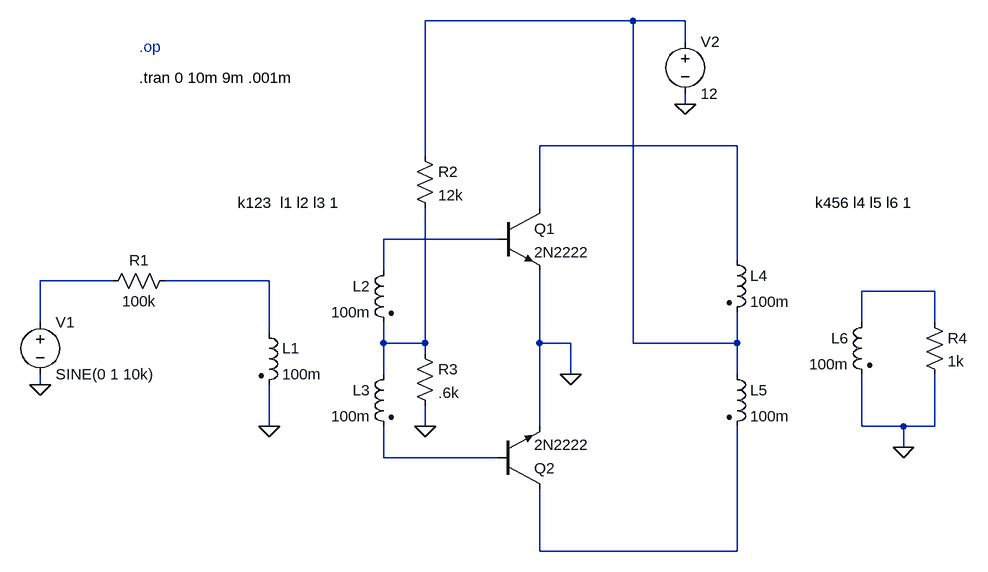
[diagram p0: schematic pushpull.asc]
pushpull.asc, the LTspice schematic file:
Version 4
SHEET 1 2424 680
WIRE 1904 -512 1584 -512
WIRE 1984 -512 1904 -512
WIRE 1984 -480 1984 -512
WIRE 1984 -384 1984 -400
WIRE 2064 -320 1760 -320
WIRE 1584 -304 1584 -512
WIRE 1760 -224 1760 -320
WIRE 1696 -176 1520 -176
WIRE 2064 -144 2064 -320
WIRE 1520 -128 1520 -176
WIRE 1104 -112 992 -112
WIRE 1344 -112 1184 -112
WIRE 2368 -96 2256 -96
WIRE 992 -48 992 -112
WIRE 2256 -48 2256 -96
WIRE 2368 -48 2368 -96
WIRE 1344 -32 1344 -112
WIRE 1520 -16 1520 -48
WIRE 1584 -16 1584 -224
WIRE 1584 -16 1520 -16
WIRE 1760 -16 1760 -128
WIRE 1808 -16 1760 -16
WIRE 1904 -16 1904 -512
WIRE 2064 -16 2064 -64
WIRE 2064 -16 1904 -16
WIRE 1584 0 1584 -16
WIRE 1520 32 1520 -16
WIRE 1808 32 1808 -16
WIRE 2064 32 2064 -16
WIRE 992 48 992 32
WIRE 1344 112 1344 48
WIRE 1584 112 1584 80
WIRE 1760 112 1760 -16
WIRE 2256 112 2256 32
WIRE 2320 112 2256 112
WIRE 2368 112 2368 32
WIRE 2368 112 2320 112
WIRE 2320 144 2320 112
WIRE 1520 160 1520 112
WIRE 1696 160 1520 160
WIRE 1760 304 1760 208
WIRE 2064 304 2064 112
WIRE 2064 304 1760 304
FLAG 1808 32 0
FLAG 2320 144 0
FLAG 1584 112 0
FLAG 1984 -384 0
FLAG 1344 112 0
FLAG 992 48 0
DATAFLAG 1584 -16 ""
SYMBOL npn 1696 -224 R0
SYMATTR InstName Q1
SYMATTR Value 2N2222
SYMBOL npn 1696 208 M180
SYMATTR InstName Q2
SYMATTR Value 2N2222
SYMBOL ind2 2048 16 R0
SYMATTR InstName L5
SYMATTR Value 100m
SYMATTR Type ind
SYMBOL ind2 2048 -160 R0
SYMATTR InstName L4
SYMATTR Value 100m
SYMATTR Type ind
SYMBOL ind2 2272 -64 M0
SYMATTR InstName L6
SYMATTR Value 100m
SYMATTR Type ind
SYMBOL res 2352 -64 R0
SYMATTR InstName R4
SYMATTR Value 1k
SYMBOL ind2 1536 -144 M0
SYMATTR InstName L2
SYMATTR Value 100m
SYMATTR Type ind
SYMBOL ind2 1536 16 M0
SYMATTR InstName L3
SYMATTR Value 100m
SYMATTR Type ind
SYMBOL res 1568 -16 R0
SYMATTR InstName R3
SYMATTR Value .6k
SYMBOL res 1568 -320 R0
SYMATTR InstName R2
SYMATTR Value 12k
SYMBOL voltage 1984 -496 R0
WINDOW 123 0 0 Left 0
WINDOW 39 0 0 Left 0
SYMATTR InstName V2
SYMATTR Value 12
SYMBOL ind2 1328 -48 R0
SYMATTR InstName L1
SYMATTR Value 100m
SYMATTR Type ind
SYMBOL res 1200 -128 R90
WINDOW 0 0 56 VBottom 2
WINDOW 3 32 56 VTop 2
SYMATTR InstName R1
SYMATTR Value 100k
SYMBOL voltage 992 -64 R0
WINDOW 123 0 0 Left 0
WINDOW 39 0 0 Left 0
SYMATTR InstName V1
SYMATTR Value SINE(0 1 10k)
TEXT 1144 -472 Left 2 ;.op
TEXT 1144 -424 Left 2 !.tran 0 10m 9m .001m
TEXT 2184 -232 Left 2 !k456 l4 l5 l6 1
TEXT 1296 -232 Left 2 !k123  l1 l2 l3 1

The netlist it stands for:
* pushpull.asc
Q1 N002 N003 0 0 2N2222
Q2 N009 N008 0 0 2N2222
L5 N001 N009 100m
L4 N002 N001 100m
L6 N006 0 100m
R4 N006 0 1k
L2 N003 N007 100m
L3 N007 N008 100m
R3 N007 0 .6k
R2 N001 N007 12k
V2 N001 0 12
L1 N005 0 100m
R1 N005 N004 100k
V1 N004 0 SINE(0 1 10k)
.model NPN NPN
.model PNP PNP
.lib standard.bjt
* .op
.tran 0 10m 9m .001m
k456 l4 l5 l6 1
k123  l1 l2 l3 1
.backanno
.end